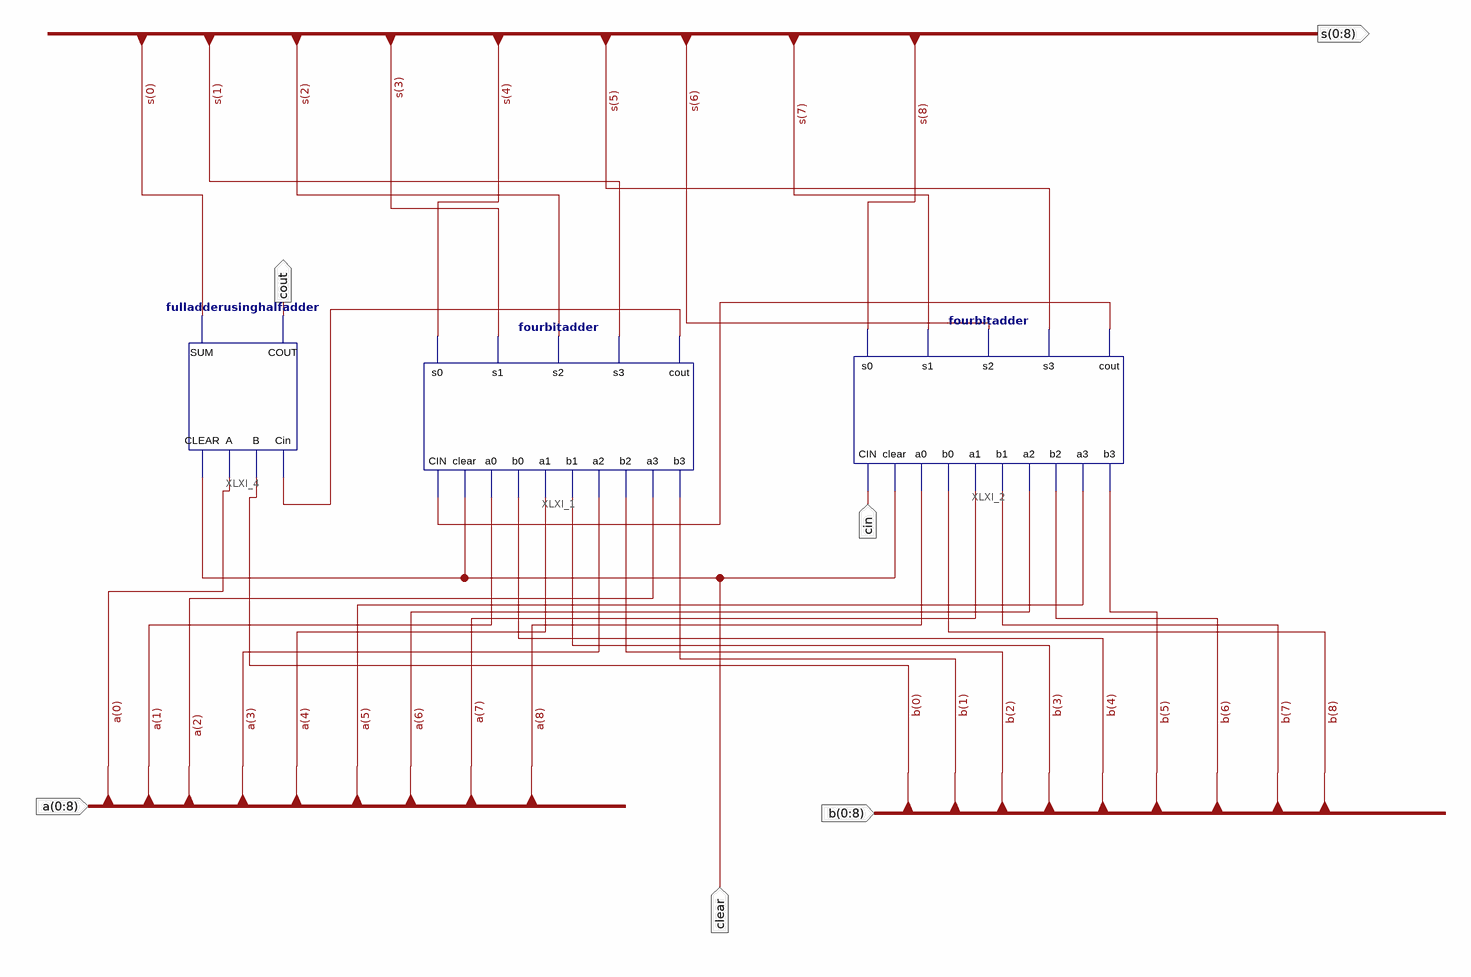
[diagram p0: schematic sheet 1]
// Xilinx ISE schematic NInebit_adder.sch (artix7) as structural Verilog: 3 symbols, 6 ports
module NInebit_adder (
  input  [0:8] a,
  input  [0:8] b,
  input  cin,
  input  clear,
  output [0:8] s,
  output cout
);

  wire XLXN_35, XLXN_37;

  fourbitadder XLXI_1 (
    .CIN(XLXN_35), .clear(clear), .a0(a[1]), .b0(b[4]), .a1(a[4]), .b1(b[3]), .a2(a[3]), .b2(b[2]),
    .a3(a[2]), .b3(b[1]), .s0(s[4]), .s1(s[3]), .s2(s[2]), .s3(s[1]), .cout(XLXN_37));
  fourbitadder XLXI_2 (
    .CIN(cin), .clear(clear), .a0(a[8]), .b0(b[8]), .a1(a[7]), .b1(b[7]), .a2(a[6]), .b2(b[6]), .a3(a[5]),
    .b3(b[5]), .s0(s[8]), .s1(s[7]), .s2(s[6]), .s3(s[5]), .cout(XLXN_35));
  fulladderusinghalfadder XLXI_4 (.CLEAR(clear), .A(a[0]), .B(b[0]), .Cin(XLXN_37), .SUM(s[0]), .COUT(cout));
endmodule
